# EasyEDA Pro project ProProject_Kame Quadrapot_2024-12-26.epro, schematic LU9685 + Buck + charging_1
Create Date: 2024-12-16; Page Name: LU9685 + Buck + charging; Project Name: Kame Quadrapot; Schematic Name: LU9685 + Buck + charging_1; Update Date: 2024-12-18; Company: EasyEDA.com; Drawn: EasyEDA; Page Size: A3; Part Number: JLCPCB-001; Reviewed: EasyEDA; Version: V0.1
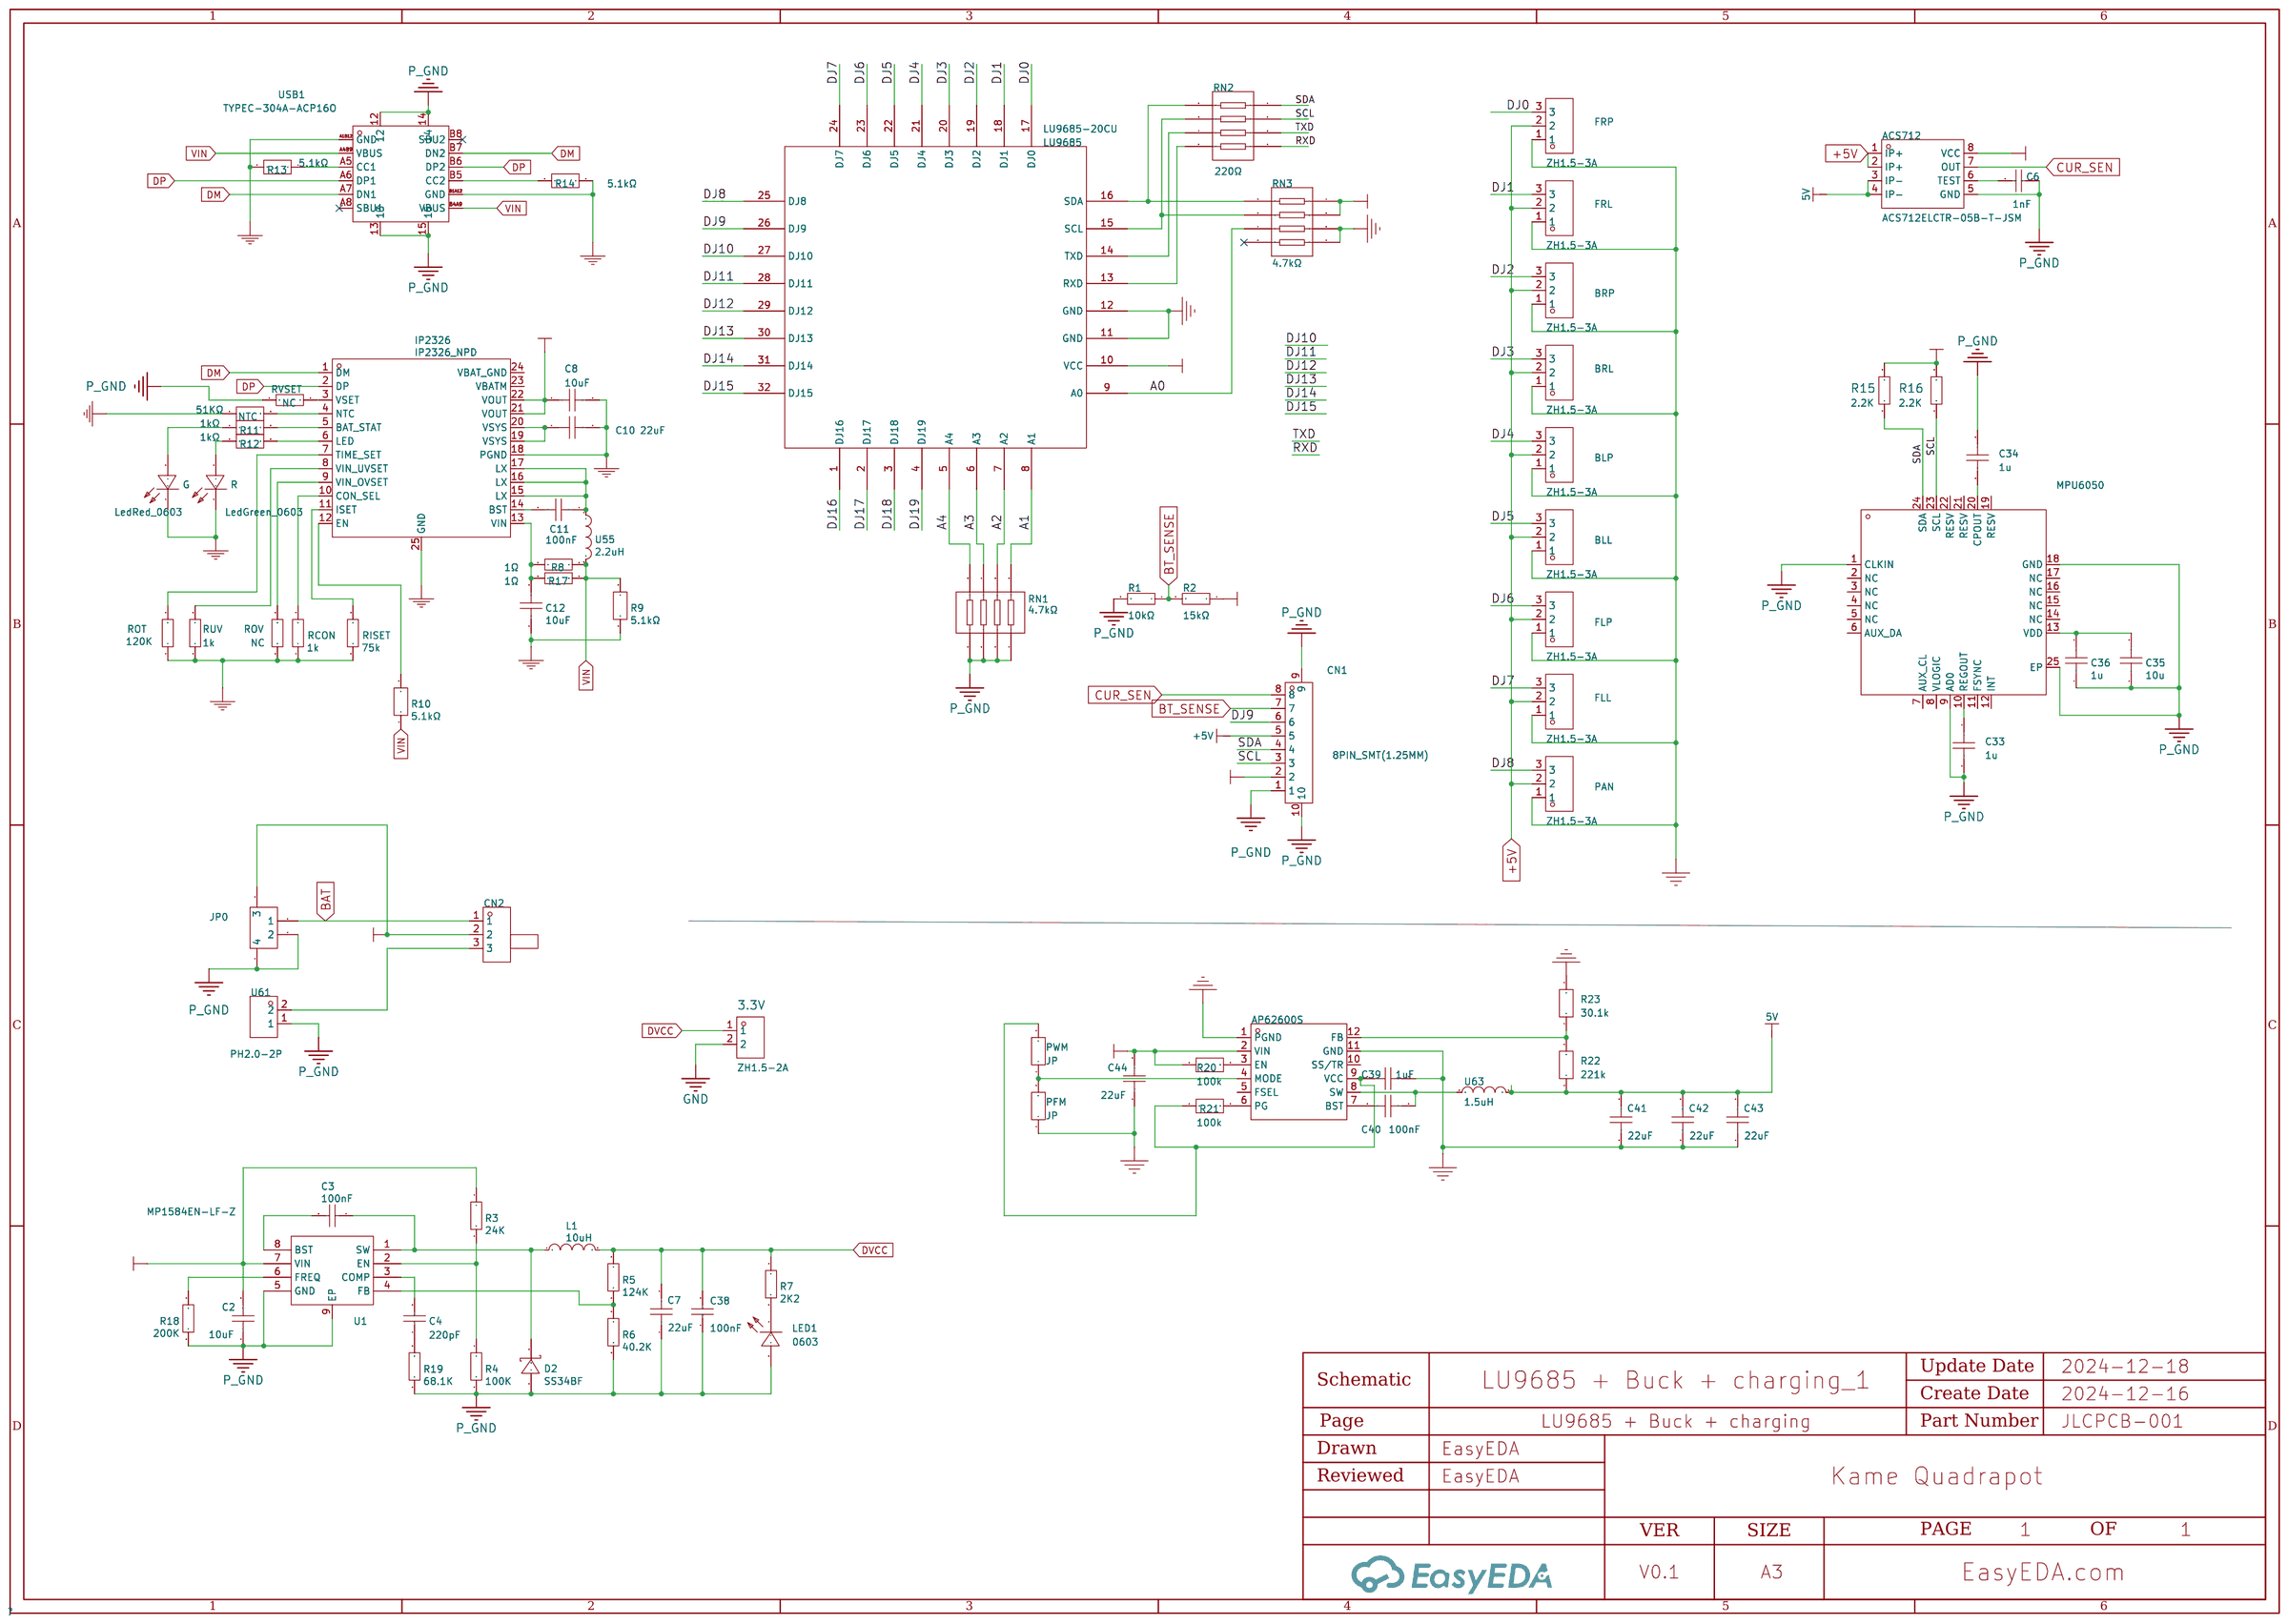
[diagram p1: schematic sheet]

## Parts
3.3V  ZH1.5-2A  [CONN-TH_ZH-1.5-2A]
ACS712  ACS712ELCTR-05B-T-JSM  [SOP-8_L4.9-W3.9-P1.27-LS6.0-BL]
AP62600S  AP62600SJ-7  [QFN-12_L3.0-W2.0-P0.50-TL_AP62600SJ-7]
BLL  ZH1.5-3A  [CONN-TH_ZH1.5-3A_C2829733]
BLP  ZH1.5-3A  [CONN-TH_ZH1.5-3A_C2829733]
BRL  ZH1.5-3A  [CONN-TH_ZH1.5-3A_C2829733]
BRP  ZH1.5-3A  [CONN-TH_ZH1.5-3A_C2829733]
C2  10uF  [R0402]
C3  100nF  [R0402]
C4  220pF  [R0402]
C6  1nF  [C0603]
C7  22uF  [C1206]
C8  10uF  [C0805]
C10  22uF  [C0805]
C11  100nF  [C0603]
C12  10uF  [C0805]
C33  1u  [C0603]
C34  1u  [C0603]
C35  10u  [C0603]
C36  1u  [C0603]
C38  100nF  [R0402]
C39  1uF  [C0402]
C40  100nF  [C0402]
C41  22uF  [C1206]
C42  22uF  [C1206]
C43  22uF  [C1206]
C44  22uF  [C1206]
CN1  8PIN_SMT(1.25MM)  [CONN-SMD_8PIN_SMT-P1.25]
CN2  -  [CONN-TH_ZH1.5-3A_C2829733]
D2  SS34BF  [DO-214AC_L4.3-W2.7-LS5.2-RD]
FLL  ZH1.5-3A  [CONN-TH_ZH1.5-3A_C2829733]
FLP  ZH1.5-3A  [CONN-TH_ZH1.5-3A_C2829733]
FRL  ZH1.5-3A  [CONN-TH_ZH1.5-3A_C2829733]
FRP  ZH1.5-3A  [CONN-TH_ZH1.5-3A_C2829733]
G  LedRed_0603  [LED0603-RD_RED]
IP2326  IP2326_NPD  [QFN-24_L4.0-W4.0-P0.50-BL-EP2.5]
JP0  HDR-1X2  [CONN-SMD_PH2.0MM-2AWB]
L1  10uH  [IND-SMD_L7.4-W6.6_ECS-MPIL0630]
LED1  0603  [LED0603-R-RD_MINI]
LU9685  LU9685-20CU  [LQFP-32_L7.0-W7.0-P0.80-LS9.0-BL]
MPU6050  MPU6050-YJLTY  [QFN-24_L4.0-W4.0-P0.50-BL-EP2.7]
NTC  51KΩ  [R0603]
PAN  ZH1.5-3A  [CONN-TH_ZH1.5-3A_C2829733]
PFM  JP  [R0402]
PWM  JP  [R0402]
R  LedGreen_0603  [LED0603-RD_GREEN]
R1  10kΩ  [R0603]
R2  15kΩ  [R0603]
R3  24K  [R0402]
R4  100K  [R0402]
R5  3V3=124/40.2  [R0402]
R6  40.2K  [R0402]
R7  2K2  [R0402]
R8  1Ω  [R0603]
R9  5.1kΩ  [R0603]
R10  5.1kΩ  [R0603]
R11  1kΩ  [R0603]
R12  1kΩ  [R0603]
R13  5.1kΩ  [R0603]
R14  5.1kΩ  [R0603]
R15  2.2K  [R0603]
R16  2.2K  [R0603]
R17  1Ω  [R0603]
R18  200K  [R0402]
R19  68.1K  [R0402]
R20  100k  [R0402]
R21  100k  [R0402]
R22  221k  [R0402]
R23  30.1k  [R0402]
RCON  1k  [R0603]
RISET  75k  [R0603]
RN1  4.7kΩ  [RES-ARRAY-SMD_0603-8P-L3.2-W1.6-BL]
RN2  220Ω  [RES-ARRAY-SMD_0603-8P-L3.2-W1.6-BL]
RN3  4.7kΩ  [RES-ARRAY-SMD_0603-8P-L3.2-W1.6-BL]
ROT  120K  [R0603]
ROV  NC  [R0603]
RUV  1k  [R0603]
RVSET  NC  [R0603]
U1  MP1584EN-LF-Z  [SOP-8_L4.9-W3.9-P1.27-LS6.0-BL-EP3.3-2]
U55  2.2uH  [IND-SMD_L6.7-W6.5]
U61  PH2.0-2P  [2.54mm_1*2P_oval]
U63  1.5uH  [IND-SMD_L11.6-W10.1]
USB1  TYPEC-304A-ACP16O  [USB-SMD_TYPEC-304A-ACP16O]

## Library data of the parts
3.3V = ZH1.5-2A_C722910: Pins Structure:1x2P Pitch:1.5mm Mounting Style:Straight Reference Series:ZH Number of Pins:2P Number of Rows:1 Number of PINs Per Row:2 Row Spacing:- Current Rating (Max):1A Operating Temperature Range:-25℃~+85℃ Operating Temperature Range:-25℃~+85℃; LCSC Part Name: 1x2P 间距:1.5mm 直插 系列:ZH; Supplier Part: C722910; Manufacturer: CAX(创都); Supplier Footprint: 插件,P=1.5mm; JLCPCB Part Class: Extended Part; Datasheet: https://atta.szlcsc.com/upload/public/pdf/source/20200902/C722910_3A606E9023366FB4B71ACF538A145687.pdf; Supplier: LCSC; Pins Structure: 1x2P; Pitch: 1.5mm; Mounting Style: Straight; Reference Series: ZH; Number of Pins: 2P; Number of Rows: 1; Number of PINs Per Row: 2; Current Rating (Max): 1A; Operating Temperature Range: -25℃~+85℃
ACS712 = ACS712ELCTR-05B-T-JSM: Current Range:5A Current Range:5A Supply Voltage:4.5V~5.5V Supply Voltage:4.5V~5.5V Sensitivity:185mV/A Operating Temperature:-40℃~+150℃ Operating Temperature:-40℃~+150℃; Supplier Part: C19673779; Manufacturer: JSMSEMI(杰盛微); Supplier Footprint: SOP-8; JLCPCB Part Class: Extended Part; Datasheet: https://atta.szlcsc.com/upload/public/pdf/source/20240223/96E2A298C26713E10FE0B9BE4088197B.pdf; Supplier: LCSC; Current Range: 5A; Supply Voltage: 4.5V~5.5V; Sensitivity: 185mV/A; Operating Temperature: -40℃~+150℃
AP62600S = AP62600SJ-7: Function:Step-down type Output Type:- Input Voltage:4.5V~18V Input Voltage:4.5V~18V Output Voltage:600mV~7V Output Voltage:600mV~7V Output Current:6A Switching Frequency:400kHz~1.2MHz Switching Frequency:400kHz~1.2MHz Operating Temperature:-40℃~+125℃ Oper; LCSC Part Name: 6A同步降压转换器，4.5V至18V输入电压范围; Supplier Part: C4748917; Manufacturer: DIODES(美台); Supplier Footprint: QFN-12(2x3); JLCPCB Part Class: Extended Part; Datasheet: https://atta.szlcsc.com/upload/public/pdf/source/20220719/44572B5D01F8C2595B766C608FD13EC1.pdf; Supplier: LCSC; Function: Step-down type; Input Voltage: 4.5V~18V; Output Voltage: 600mV~7V; Output Current: 6A; Switching Frequency: 400kHz~1.2MHz; Operating Temperature: -40℃~+125℃; Synchronous Rectification: Yes; Number of Outputs: 1; Topology: Step-down; Switch tube (built-in/external): Built-in
BLL BLP BRL BRP FLL FLP FRL FRP PAN = ZH1.5-3A: Pins Structure:1x3P Pitch:1.5mm Mounting Style:Direct Insert Reference Series:ZH Number of Pins:3P Number of Rows:1 Number of PINs Per Row:3 Current Rating (Max):1A Contact Material:Brass Contact Plating:Tin Operating Temperature Range:-25℃~+85℃ Operating; LCSC Part Name: 1x3P 间距:1.5mm 直插 系列:ZH; Supplier Part: C2829733; Manufacturer: FG(富港); Supplier Footprint: 插件,P=1.5mm; JLCPCB Part Class: Extended Part; Datasheet: https://atta.szlcsc.com/upload/public/pdf/source/20210425/C2829732_F26530E371F6662D5811C22FF273BDDC.pdf; Supplier: LCSC; Pins Structure: 1x3P; Pitch: 1.5mm; Mounting Style: Direct Insert; Reference Series: ZH; Number of Pins: 3P; Number of Rows: 1; Number of PINs Per Row: 3; Current Rating (Max): 1A; Contact Material: Brass; Contact Plating: Tin; Operating Temperature Range: -25℃~+85℃; Rated Voltage (Max): 100V
C2 = 10uF: Supplier: LCSC; Supplier Part: C141046; Manufacturer: KEMET; Manufacturer Part: C1210C106M4PAC7800; JLCPCB Part Class: Extended Part
C3 C38 = 100nF: Supplier: LCSC; Manufacturer: HEC; Manufacturer Part: C0805N101J201T; Supplier Part: C105912; JLCPCB Part Class: Extended Part
C4 = 100pF: Supplier: LCSC; Manufacturer: HEC; Manufacturer Part: C0805N101J201T; Supplier Part: C105912; JLCPCB Part Class: Extended Part
C6 = CL21B102KBCNNNC: Capacitance: Tolerance:±10% Tolerance:±10% Voltage Rated: Temperature Coefficient:; LCSC Part Name: 1nF ±10% 50V; Supplier Part: C46653; Manufacturer: SAMSUNG(三星); Supplier Footprint: 0805; JLCPCB Part Class: Basic Part; Datasheet: https://atta.szlcsc.com/upload/public/pdf/source/20160218/1457707763339.pdf; Supplier: LCSC; Tolerance: ±10%
C7 C41-C44 = 22uF: Supplier: LCSC; Supplier Part: C141046; Manufacturer: KEMET; Manufacturer Part: C1210C106M4PAC7800; JLCPCB Part Class: Extended Part
C8 = 10uF: Supplier: LCSC; Manufacturer: TDK; Manufacturer Part: C2012X6S1C106M085AC; Supplier Part: C3865551; JLCPCB Part Class: Extend; JLCPCB SMD: Yes
C10 = 22uF: Supplier: LCSC; Supplier Part: C3908819; Manufacturer: TDK; Manufacturer Part: C2012X6S0J226M085AC
C11 = 100nF: Supplier: LCSC; Supplier Part: C138344; Manufacturer: null; Manufacturer Part: CT41-0603-2F4-50V-0.1uF-M(N); JLCPCB Part Class: Extended Part
C12 = 10uF: Supplier: LCSC; Supplier Part: C3894687; Manufacturer: TDK; Manufacturer Part: C2012X5R1V106M085AC
C33 C34 C36 = 1u: Manufacturer Part: ?
C35 = 10u: Manufacturer Part: ?
C39 C40 = C0603X105K025T: Capacitance: Tolerance:±10% Tolerance:±10% Voltage Rated: Temperature Coefficient:; LCSC Part Name: 1uF ±10% 25V; Supplier Part: C559292; Manufacturer: IHHEC(禾伸堂); Supplier Footprint: 0603; JLCPCB Part Class: Extended Part; Datasheet: https://atta.szlcsc.com/upload/public/pdf/source/20181218/C172721_07ABA3A1C2D7E9B9870089BDC15ED9B1.pdf; Supplier: LCSC; Tolerance: ±10%
CN1 = 8PIN_SMT(1.25MM): Supplier Part: C9900003224; Supplier Footprint: CON-SMD-8PIN-P1.25mm; JLCPCB Part Class: Extended Part; Supplier: LCSC
CN2 = ZH1.5 connector for switch
D2 = SS34BF: Supplier: LCSC; Manufacturer: Jingdao; Supplier Part: C108836; JLCPCB Part Class: Extended Part
G = LedRed_0603: Supplier: Mouser
IP2326 = IP2326_NPD: Supplier: LCSC; Supplier Part: C5441281; Manufacturer: INJOINIC(英集芯); JLCPCB Part Class: Extended Part
JP0 = HDR-1X2: 2P-Ӳ--; BOM____: 2P-Ӳ--; __Ȩ____: Դ----; ѧϰ__Դ: www.ooocke.com; Design Item ID: Header 2; Library Name: 4.6   - -Ӳ----ž-3.5
L1 = 4.7uH: Supplier: LCSC; Manufacturer: Chilisin; Manufacturer Part: MHCI06030-4R7M-R8; Supplier Part: C108295; JLCPCB Part Class: Extended Part
LED1 = 0805G: Supplier: LCSC; Manufacturer: KENTO; Manufacturer Part: 0805G (Green); image: //image.lceda.cn/szlcsc/C2297.jpg; Supplier Part: C2297; JLCPCB Part Class: Basic Part
LU9685 = LU9685-20CU: Design Item ID: STC8H1K16; Library Name: 15.1 - δ--------
MPU6050 = MPU6050-YJLTY: Supplier Part: C2912107; Supplier Footprint: QFN-24-EP(4x4); JLCPCB Part Class: Extended Part; Supplier: LCSC
NTC R9 R10 R13 R14 = 5.1kΩ: Supplier: LCSC; Supplier Part: C431786; Manufacturer: Walsin(华新科); Manufacturer Part: MR06X5101FTL; JLCPCB Part Class: Extended Part
PFM PWM R20-R23 = SCR0603F8R06: Type:Thick Film Resistors Resistance: Tolerance:±1% Tolerance:±1% Power(Watts): Overload Voltage (Max): Operating Temperature Range:-55℃~+155℃ Operating Temperature Range:-55℃~+155℃; LCSC Part Name: 厚膜电阻 8.06Ω ±1% 100mW; Supplier Part: C3016465; Manufacturer: VO(翔胜); Supplier Footprint: 0603; JLCPCB Part Class: Extended Part; Datasheet: https://atta.szlcsc.com/upload/public/pdf/source/20220513/247AF9639BA21CF93567DC289CCC6A22.pdf; Supplier: LCSC; Type: Thick Film Resistors; Tolerance: ±1%; Operating Temperature Range: -55℃~+155℃
R = LedGreen_0603: Supplier: Mouser
R1 R2 = 0603WAF1502T5E: Type:Thick Film Resistors Resistance:15kΩ Tolerance:±1% Tolerance:±1% Power(Watts): Overload Voltage (Max): Temperature Coefficient:±100ppm/℃ Temperature Coefficient:±100ppm/℃ Operating Temperature Range:-55℃~+155℃ Operating Temperature Range:-55℃~+155℃; LCSC Part Name: 15kΩ ±1% 100mW 厚膜电阻; Supplier Part: C22809; Manufacturer: UNI-ROYAL(厚声); Supplier Footprint: 0603; JLCPCB Part Class: Basic Part; Datasheet: https://atta.szlcsc.com/upload/public/pdf/source/20200306/C422600_1E6D84923E4A46A82E41ADD87F860B5C.pdf; Supplier: LCSC; Type: Thick Film Resistors; Tolerance: ±1%; Temperature Coefficient: ±100ppm/℃; Operating Temperature Range: -55℃~+155℃
R3 R4 R18 R19 = 100k: Supplier: LCSC; Manufacturer: UniOhm; Manufacturer Part: 0805W8F1001T5E; Supplier Part: C17513; JLCPCB Part Class: Basic Part
R5 = 75k: Supplier: LCSC; Manufacturer: UniOhm; Manufacturer Part: 0805W8F1001T5E; Supplier Part: C17513; JLCPCB Part Class: Basic Part
R6 = 24k: Supplier: LCSC; Manufacturer: UniOhm; Manufacturer Part: 0805W8F1001T5E; Supplier Part: C17513; JLCPCB Part Class: Basic Part
R7 = 2K2: Supplier: LCSC; Manufacturer: UniOhm; Manufacturer Part: 1206W4F1001T5E; Supplier Part: C4410; JLCPCB Part Class: Basic Part
R8 R17 = 0.56: Supplier: LCSC; Manufacturer: RALEC; Manufacturer Part: RTT05R560FTP; Supplier Part: C104585; JLCPCB Part Class: Extended Part
R11 R12 = 1kΩ: Supplier: LCSC; Supplier Part: C2918515; Manufacturer: Walsin(华新科); Manufacturer Part: WR06X102JGL; JLCPCB Part Class: Extended Part
R15 R16 = 0603WAF8201T5E: Type:Thick Film Resistors Resistance:8.2kΩ Tolerance:±1% Tolerance:±1% Power(Watts): Overload Voltage (Max): Temperature Coefficient:±100ppm/℃ Temperature Coefficient:±100ppm/℃ Operating Temperature Range:-55℃~+155℃ Operating Temperature Range:-55℃~+155℃; LCSC Part Name: 8.2kΩ ±1% 100mW 厚膜电阻; Supplier Part: C25981; Manufacturer: UNI-ROYAL(厚声); Supplier Footprint: 0603; JLCPCB Part Class: Basic Part; Datasheet: https://atta.szlcsc.com/upload/public/pdf/source/20200306/C422600_1E6D84923E4A46A82E41ADD87F860B5C.pdf; Supplier: LCSC; Type: Thick Film Resistors; Tolerance: ±1%; Temperature Coefficient: ±100ppm/℃; Operating Temperature Range: -55℃~+155℃
RCON ROV RUV RVSET = 1k: Supplier: LCSC; Supplier Part: C9900013964; Manufacturer: null; Manufacturer Part: CN0603R103B3435FT; JLCPCB Part Class: Extended Part
RISET = 75k: Supplier: LCSC; Supplier Part: C9900013964; Manufacturer: null; Manufacturer Part: CN0603R103B3435FT; JLCPCB Part Class: Extended Part
RN1-RN3 = 4D03WGJ0472T5E: Number of Resistors: Resistance:4.7kΩ Tolerance:±5% Tolerance:±5% Power(Watts): Temperature Coefficient:±200ppm/℃ Temperature Coefficient:±200ppm/℃ Number of Pins:; LCSC Part Name: 4.7kΩ ±5%; Supplier Part: C1980; Manufacturer: UNI-ROYAL(厚声); Supplier Footprint: 0603x4; JLCPCB Part Class: Basic Part; Datasheet: https://atta.szlcsc.com/upload/public/pdf/source/20191224/C474318_2527498AE30E813171187CCD28401A71.pdf; Supplier: LCSC; Tolerance: ±5%; Temperature Coefficient: ±200ppm/℃
ROT = 120K: Supplier: LCSC; Supplier Part: C9900013964; Manufacturer: null; Manufacturer Part: CN0603R103B3435FT; JLCPCB Part Class: Extended Part
U1 = MP1584EN-LF-Z: Supplier: LCSC; Manufacturer: MPS; Supplier Part: C15051; JLCPCB Part Class: Extended Part
U55 = 2.2uH: Supplier: LCSC; Supplier Part: C3911671; Manufacturer: Coilcraft(线艺); Manufacturer Part: XGL6060-222MEC
U61 = PH2.0-2P: Supplier Part: C9900095162; Supplier Footprint: CONN-TH_2P-P2.00_BOSSIE_BX-PH2.0-2PZZ; JLCPCB Part Class: Extended Part; Supplier: LCSC
U63 = CKST1004-1.5uH/M-B: Inductance: Tolerance:±20% Tolerance:±20% Rated Current: Saturation Current (Isat):22A DC Resistance (DCR): Type:Integrated molded inductor; LCSC Part Name: 1.5uH ±20% 22A; Supplier Part: C3002680; Manufacturer: CENKER(岑科); Supplier Footprint: SMD,10.1x11.6mm; JLCPCB Part Class: Extended Part; Datasheet: https://atta.szlcsc.com/upload/public/pdf/source/20220510/B48FE89972EB9627500571FF6CB43AFA.pdf; Supplier: LCSC; Tolerance: ±20%; Saturation Current (Isat): 22A; Type: Integrated molded inductor
USB1 = TYPEC-304A-ACP16O: Supplier: LCSC; Supplier Part: C2909610; Manufacturer: XUNPU(讯普); JLCPCB Part Class: Extended Part

## Nets
5V: ACS712.3(IP-) ACS712.4(IP-) C41.2 C42.2 C43.2 R22.1 U63.2
+5V: ACS712.1(IP+) ACS712.2(IP+) BLL.2 BLP.2 BRL.2 BRP.2 CN1.5 FLL.2 FLP.2 FRL.2 FRP.2 PAN.2
DVCC: 3.3V.1 ACS712.8(VCC) C7.2 C38.2 CN1.2 L1.2 LU9685.10(VCC) R5.1 R7.1 R15.2 R16.2 RN3.3 RN3.4
GND: 3.3V.2
VIN: R8.2 R9.2 R10.1 R17.2 U55.2 USB1.A4B9(VBUS) USB1.B4A9(VBUS)
A0: LU9685.9(A0) RN3.7
A1: LU9685.8(A1) RN1.5
A2: LU9685.7(A2) RN1.6
A3: LU9685.6(A3) RN1.7
A4: LU9685.5(A4) RN1.8
BAT: C8.1 CN2.1 IP2326.21(VOUT) IP2326.22(VOUT) JP0.2(1)
BAT+: AP62600S.2(VIN) C2.2 C44.2 CN2.2 JP0.3 R2.1 R3.1 R20.1 U1.7(VIN)
BT_SENSE: CN1.7 R1.1 R2.2
CUR_SEN: ACS712.7(OUT) CN1.8
DJ0: FRP.3 LU9685.17(DJ0)
DJ1: FRL.3 LU9685.18(DJ1)
DJ2: BRP.3 LU9685.19(DJ2)
DJ3: BRL.3 LU9685.20(DJ3)
DJ4: BLP.3 LU9685.21(DJ4)
DJ5: BLL.3 LU9685.22(DJ5)
DJ6: FLP.3 LU9685.23(DJ6)
DJ7: FLL.3 LU9685.24(DJ7)
DJ8: LU9685.25(DJ8) PAN.3
DJ9: CN1.6 LU9685.26(DJ9)
DJ10: LU9685.27(DJ10)
DJ11: LU9685.28(DJ11)
DJ12: LU9685.29(DJ12)
DJ13: LU9685.30(DJ13)
DJ14: LU9685.31(DJ14)
DJ15: LU9685.32(DJ15)
DJ16: LU9685.1(DJ16)
DJ17: LU9685.2(DJ17)
DJ18: LU9685.3(DJ18)
DJ19: LU9685.4(DJ19)
DM: IP2326.1(DM) USB1.A7(DN1) USB1.B7(DN2)
DP: IP2326.2(DP) USB1.A6(DP1) USB1.B6(DP2)
P_GND: ACS712.5(GND) AP62600S.1(PGND) AP62600S.11(GND) BLL.1 BLP.1 BRL.1 BRP.1 C2.1 C6.2 C7.1 C8.2 C10.2 C12.1 C33.2 C34.2 C35.1 C36.1 C38.1 C39.2 C41.1 C42.1 C43.1 C44.1 CN1.1 CN1.9 CN1.10 D2.2(A) FLL.1 FLP.1 FRL.1 FRP.1 G.1(K) IP2326.18(PGND) IP2326.25(GND) JP0.1(2) JP0.4 LED1.2(A) LU9685.11(GND) LU9685.12(GND) MPU6050.1(CLKIN) MPU6050.9(AD0) MPU6050.18(GND) MPU6050.25(EP) NTC.1 PAN.1 PFM.1 R.1(K) R1.2 R4.2 R6.2 R9.1 R13.2 R14.1 R18.2 R19.2 R23.2 RCON.1 RISET.1 RN1.1 RN1.2 RN1.3 RN1.4 RN3.1 RN3.2 ROT.1 ROV.1 RUV.1 RVSET.2 U1.5(GND) U1.9(EP) U61.1 USB1.12 USB1.13 USB1.14 USB1.15 USB1.A1B12(GND) USB1.B1A12(GND)
RXD: RN2.1
SCL: CN1.3 MPU6050.23(SCL) R16.1 RN2.3
SDA: CN1.4 MPU6050.24(SDA) R15.1 RN2.4
TXD: RN2.2
$1N2: LU9685.16(SDA) RN2.5 RN3.5
$1N6832: LU9685.14(TXD) RN2.7
$1N6846: LU9685.13(RXD) RN2.8
$1N6878: LU9685.15(SCL) RN2.6 RN3.6
$1N9487: C10.1 IP2326.19(VSYS) IP2326.20(VSYS)
$1N9489: C11.2 IP2326.14(BST)
$1N9490: C11.1 IP2326.15(LX) IP2326.16(LX) IP2326.17(LX) U55.1
$1N9492: C12.2 IP2326.13(VIN) R8.1 R17.1
$1N9496: R14.2 USB1.B5(CC2)
$1N9497: R13.1 USB1.A5(CC1)
$1N9501: IP2326.4(NTC) NTC.2
$1N9502: IP2326.5(BAT_STAT) R11.2
$1N9503: IP2326.6(LED) R12.2
$1N9504: R.2(A) R12.1
$1N9505: G.2(A) R11.1
$1N9508: IP2326.10(CON_SEL) RCON.2
$1N9510: IP2326.8(VIN_UVSET) RUV.2
$1N9511: IP2326.7(TIME_SET) ROT.2
$1N9512: IP2326.11(ISET) RISET.2
$1N9513: IP2326.12(EN) R10.2
$1N13576: IP2326.9(VIN_OVSET) ROV.2
$1N15007: ACS712.6(TEST) C6.1
$1N16837: IP2326.3(VSET) RVSET.1
$1N21828: C34.1 MPU6050.20(CPOUT)
$1N21877: C35.2 C36.2 MPU6050.13(VDD)
$1N25378: C33.1 MPU6050.10(REGOUT)
$1N28770: CN2.3 U61.2
$1N32350: C3.1 D2.1(C) L1.1 U1.1(SW)
$1N32352: R18.1 U1.6(FREQ)
$1N32353: R5.2 R6.1 U1.4(FB)
$1N32354: C3.2 U1.8(BST)
$1N32356: R3.2 R4.1 U1.2(EN)
$1N32357: C4.2 U1.3(COMP)
$1N32372: C4.1 R19.1
$1N32894: AP62600S.3(EN) R20.2
$1N32978: AP62600S.6(PG) R21.2
$1N33107: AP62600S.7(BST) C40.2
$1N33225: AP62600S.8(SW) C40.1 U63.1
$1N35395: AP62600S.12(FB) R22.2 R23.1
$1N42685: AP62600S.4(MODE) PFM.2 PWM.1
$1N42697: AP62600S.9(VCC) C39.1 PWM.2 R21.1
$1N46249: LED1.1(K) R7.2

Not connected (* = marked no-connect by the designer): AP62600S 5(FSEL) 10(SS/TR); IP2326 23(VBATM) 24(VBAT_GND); MPU6050 2(NC) 3(NC) 4(NC) 5(NC) 6(AUX_DA) 7(AUX_CL) 8(VLOGIC) 11(FSYNC) 12(INT) 14(NC) 15(NC) 16(NC) 17(NC) 19(RESV) 21(RESV) 22(RESV); RN3 8*; USB1 A8(SBU1)* B8(SBU2)*
